# EasyEDA schematic Schematic_Attiny 85 Flashhat.json
TITLE: Attiny85 Flash and Project Shield; REV: 1.0; Date: 2019-09-13; Sheet: 1/1
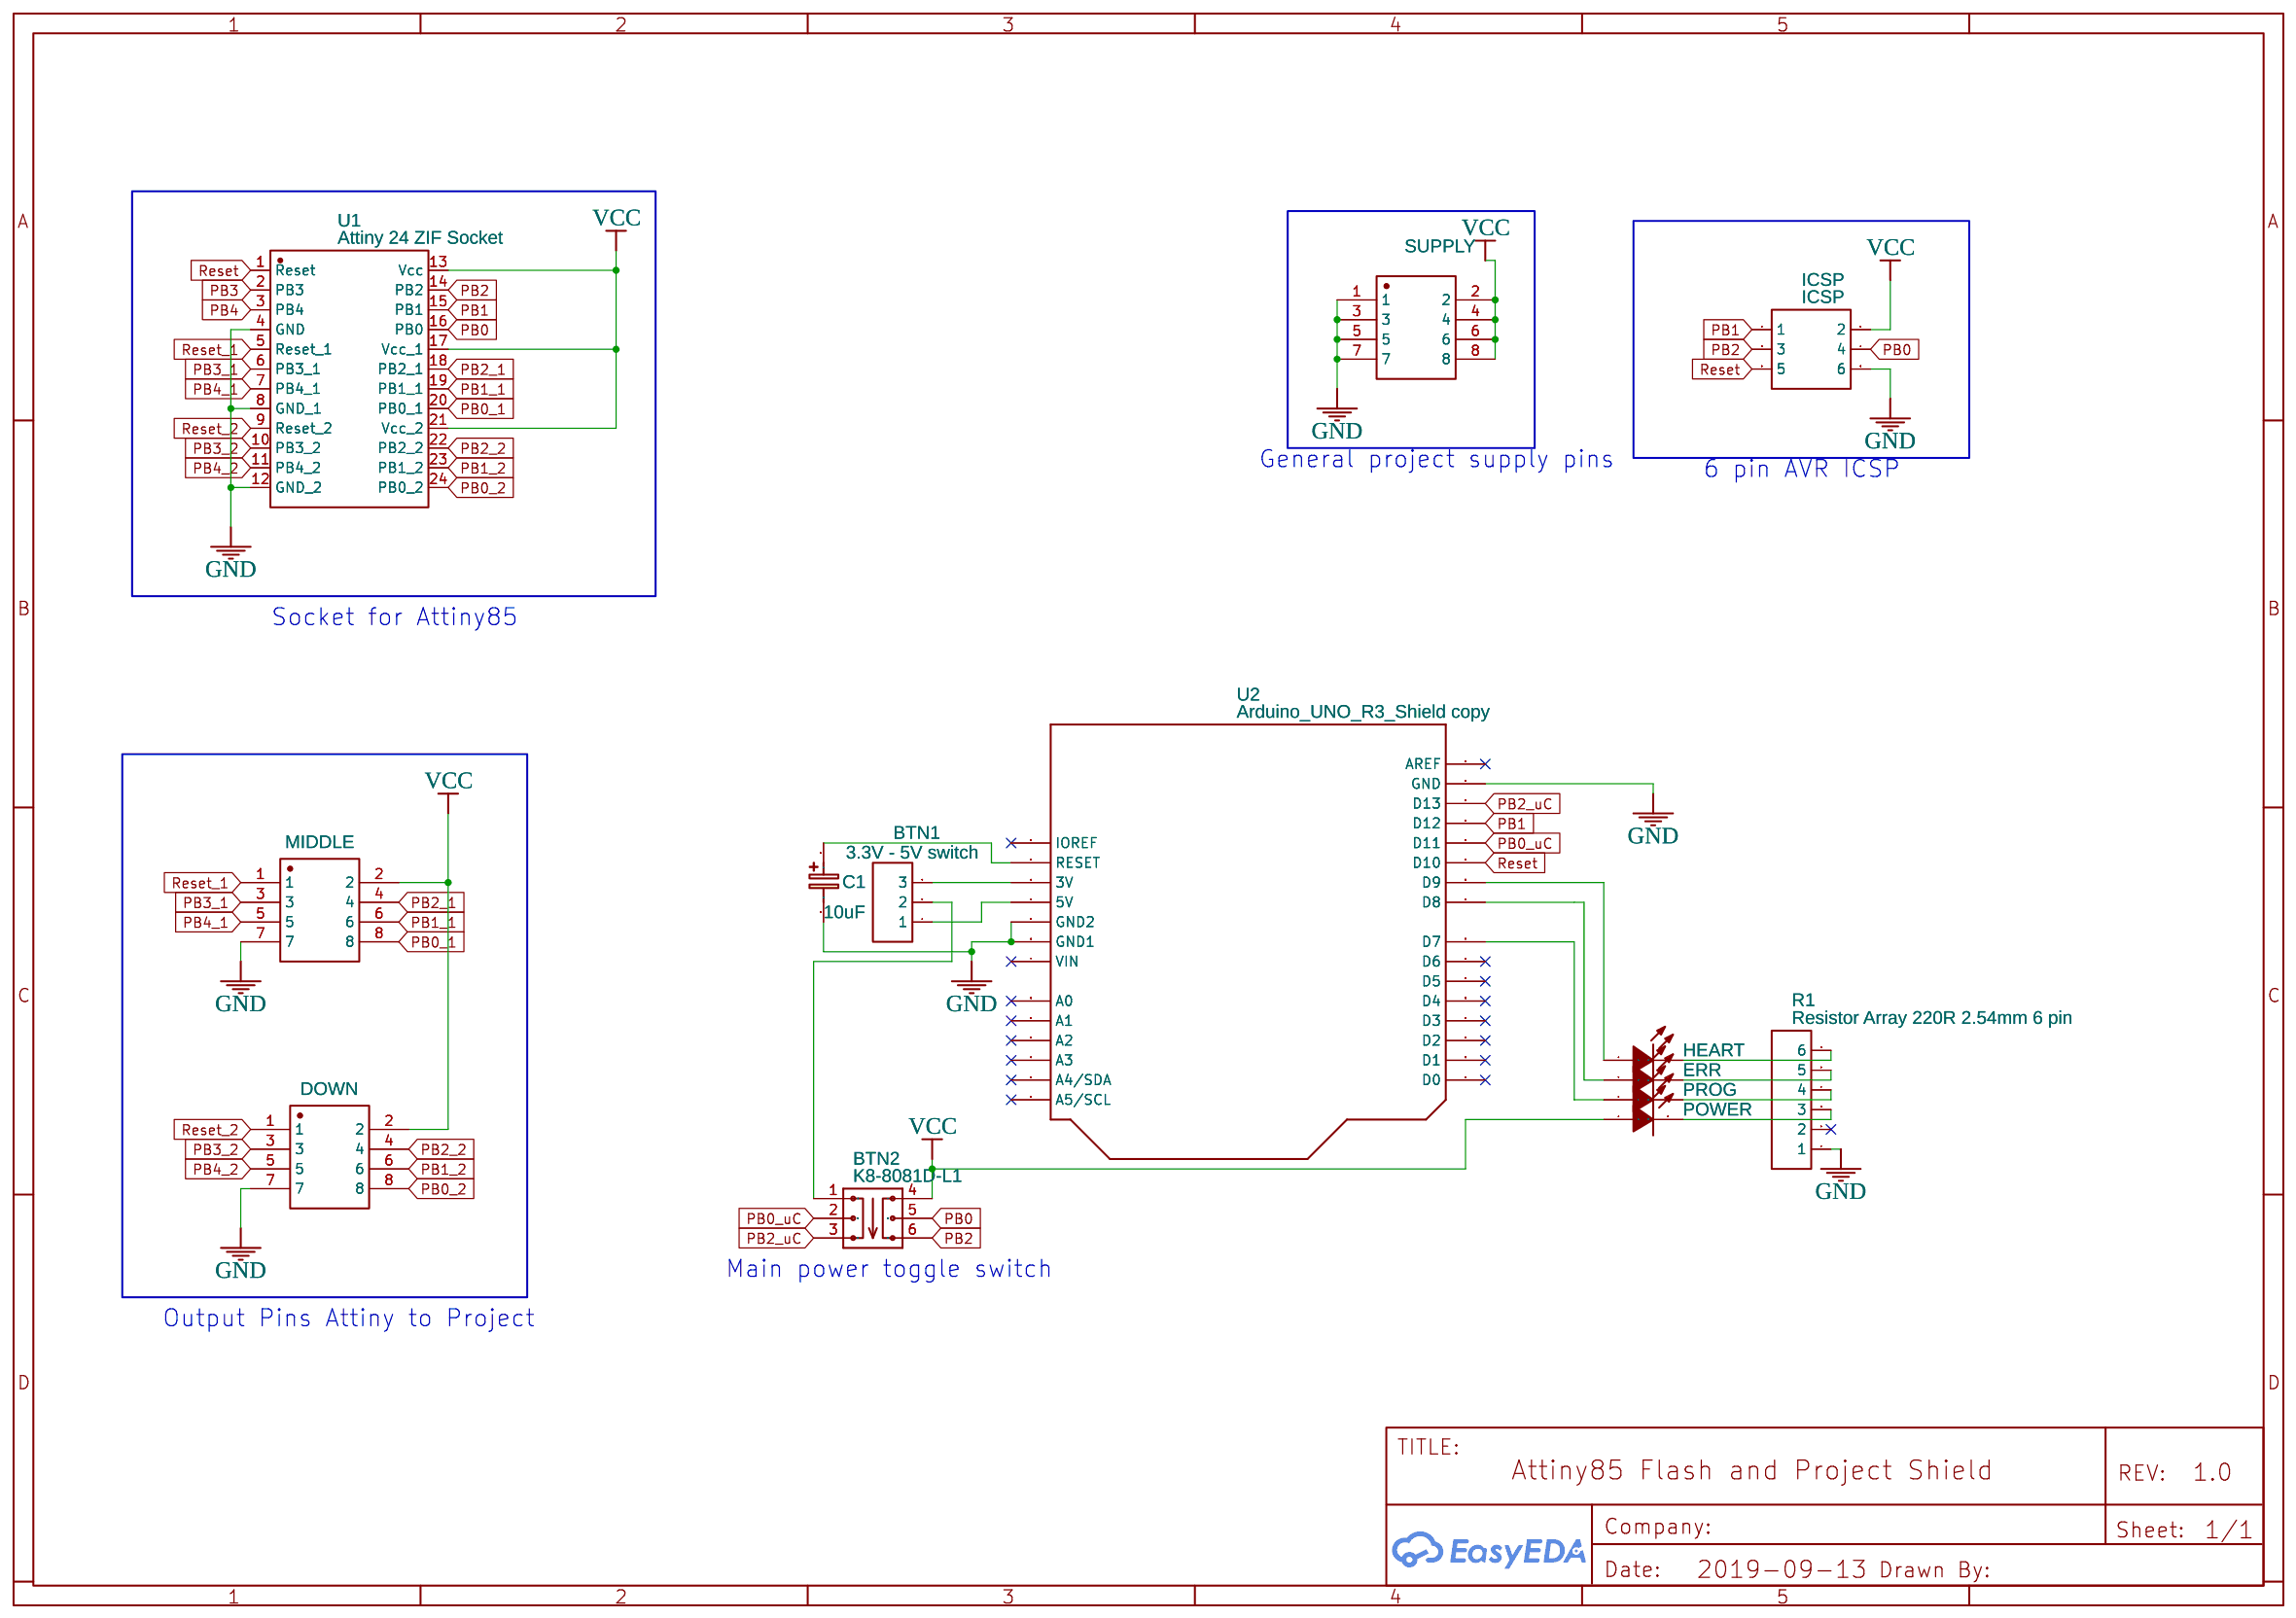
[diagram p0: schematic sheet]

## Parts
BTN1  3.3V - 5V switch  [HDR-3X1/2.54]
BTN2  K8-8081D-L1  [KEY-8X8]
C1  10uF  [CAP-D3.0XF1.5]
DOWN  210S-2*4P L=11.6MMGold-plated black  [210S-2.54-2X4P]
ERR  17-21SURC/S530-A2/TR8  [LED-0805]
HEART  17-21SURC/S530-A2/TR8  [LED-0805]
ICSP  ICSP  [HDR-TH_6PIN-V-ROW2-COL3-MALE-PITCH2.54]
MIDDLE  210S-2*4P L=11.6MMGold-plated black  [210S-2.54-2X4P]
POWER  17-21SURC/S530-A2/TR8  [LED-0805]
PROG  17-21SURC/S530-A2/TR8  [LED-0805]
R1  Resistor Array 220R 2.54mm 6 pin  [HDR-6X1/2.54]
SUPPLY  210S-2*4P L=11.6MMGold-plated black  [210S-2.54-2X4P]
U1  Attiny 24 ZIF Socket  [ZIF 24 TEST SOCKET]
U2  Arduino_UNO_R3_Shield copy  [ARDUINO_UNO_R3_SHIELD]

## Library data of the parts
BTN1 = -: Supplier: LCSC; Manufacturer: BOOMELE; Manufacturer Part: Header2.54mm 1*3P; image: //image.lceda.cn/szlcsc/C49257.jpg; Supplier Part: C49257
BTN2 = -: Supplier: LCSC; Manufacturer: HRO; Contributor: LCSC; Supplier Part: C124009
C1 = Cap_Electrolytic(TH)_D3.0XF1.5_EU: Contributor: EasyEDA
DOWN MIDDLE SUPPLY = -: Supplier: LCSC; Manufacturer: Ckmtw; Contributor: LCSC; Supplier Part: C124386
ERR HEART POWER PROG = -: Supplier: LCSC; Manufacturer: EVERLIGHT; Contributor: LCSC; Supplier Part: C131244
ICSP = -: Supplier: LCSC; Manufacturer: BOOMELE; Manufacturer Part: Header-Male-2.54_2x3; Supplier Part: C65114
R1 = -: Supplier: LCSC; Manufacturer: BOOMELE; Manufacturer Part: Header-Male-2.54_1x6; Supplier Part: C37208
U1 = -: link: https://www.aliexpress.com/item/32964106913.html?spm=a2g0o.cart.0.0.4d503c00TsHBGH&mp=1; Contributor: part.jackpot
U2 = -: Manufacturer Part: Arduino_UNO_R3_Shield; Contributor: amit071089

## Nets
GND: C1.2 DOWN.7 ICSP.6 MIDDLE.7 R1.1 SUPPLY.1 SUPPLY.3 SUPPLY.5 SUPPLY.7 U1.4(GND) U1.8(GND_1) U1.12(GND_2) U2.5(GND2) U2.6(GND1) U2.28(GND)
VCC: BTN2.4 DOWN.2 ICSP.2 MIDDLE.2 POWER.1(A) SUPPLY.2 SUPPLY.4 SUPPLY.6 SUPPLY.8 U1.13(Vcc) U1.17(Vcc_1) U1.21(Vcc_2)
PB0: BTN2.5 ICSP.4 U1.16(PB0)
PB0_1: MIDDLE.8 U1.20(PB0_1)
PB0_2: DOWN.8 U1.24(PB0_2)
PB0_uC: BTN2.2 U2.25(D11)
PB1: ICSP.1 U1.15(PB1) U2.26(D12)
PB1_1: MIDDLE.6 U1.19(PB1_1)
PB1_2: DOWN.6 U1.23(PB1_2)
PB2: BTN2.6 ICSP.3 U1.14(PB2)
PB2_1: MIDDLE.4 U1.18(PB2_1)
PB2_2: DOWN.4 U1.22(PB2_2)
PB2_uC: BTN2.3 U2.27(D13)
PB3: U1.2(PB3)
PB3_1: MIDDLE.3 U1.6(PB3_1)
PB3_2: DOWN.3 U1.10(PB3_2)
PB4: U1.3(PB4)
PB4_1: MIDDLE.5 U1.7(PB4_1)
PB4_2: DOWN.5 U1.11(PB4_2)
Reset: ICSP.5 U1.1(Reset) U2.24(D10)
Reset_1: MIDDLE.1 U1.5(Reset_1)
Reset_2: DOWN.1 U1.9(Reset_2)
Net-(BTN1-1): BTN1.1 U2.4(5V)
Net-(BTN1-2): BTN1.2 BTN2.1
Net-(BTN1-3): BTN1.3 U2.3(3V)
Net-(C1-1): C1.1 U2.2(RESET)
Net-(ERR-1): ERR.1(A) U2.22(D8)
Net-(ERR-2): ERR.2(K) R1.5
Net-(HEART-1): HEART.1(A) U2.23(D9)
Net-(HEART-2): HEART.2(K) R1.6
Net-(POWER-2): POWER.2(K) R1.3
Net-(PROG-1): PROG.1(A) U2.21(D7)
Net-(PROG-2): PROG.2(K) R1.4

Not connected (* = marked no-connect by the designer): R1 2*; U2 1(IOREF)* 7(VIN)* 8(A0)* 9(A1)* 10(A2)* 11(A3)* 12(A4/SDA)* 13(A5/SCL)* 14(D0)* 15(D1)* 16(D2)* 17(D3)* 18(D4)* 19(D5)* 20(D6)* 29(AREF)*

## Notes on the sheet
- General project supply pins
- 6 pin AVR ICSP
- Socket for Attiny85
- Main power toggle switch
- Output Pins Attiny to Project
